# Altium schematic sheet main.SchDoc
size A3; SheetNumber: 1; SheetTotal: 4
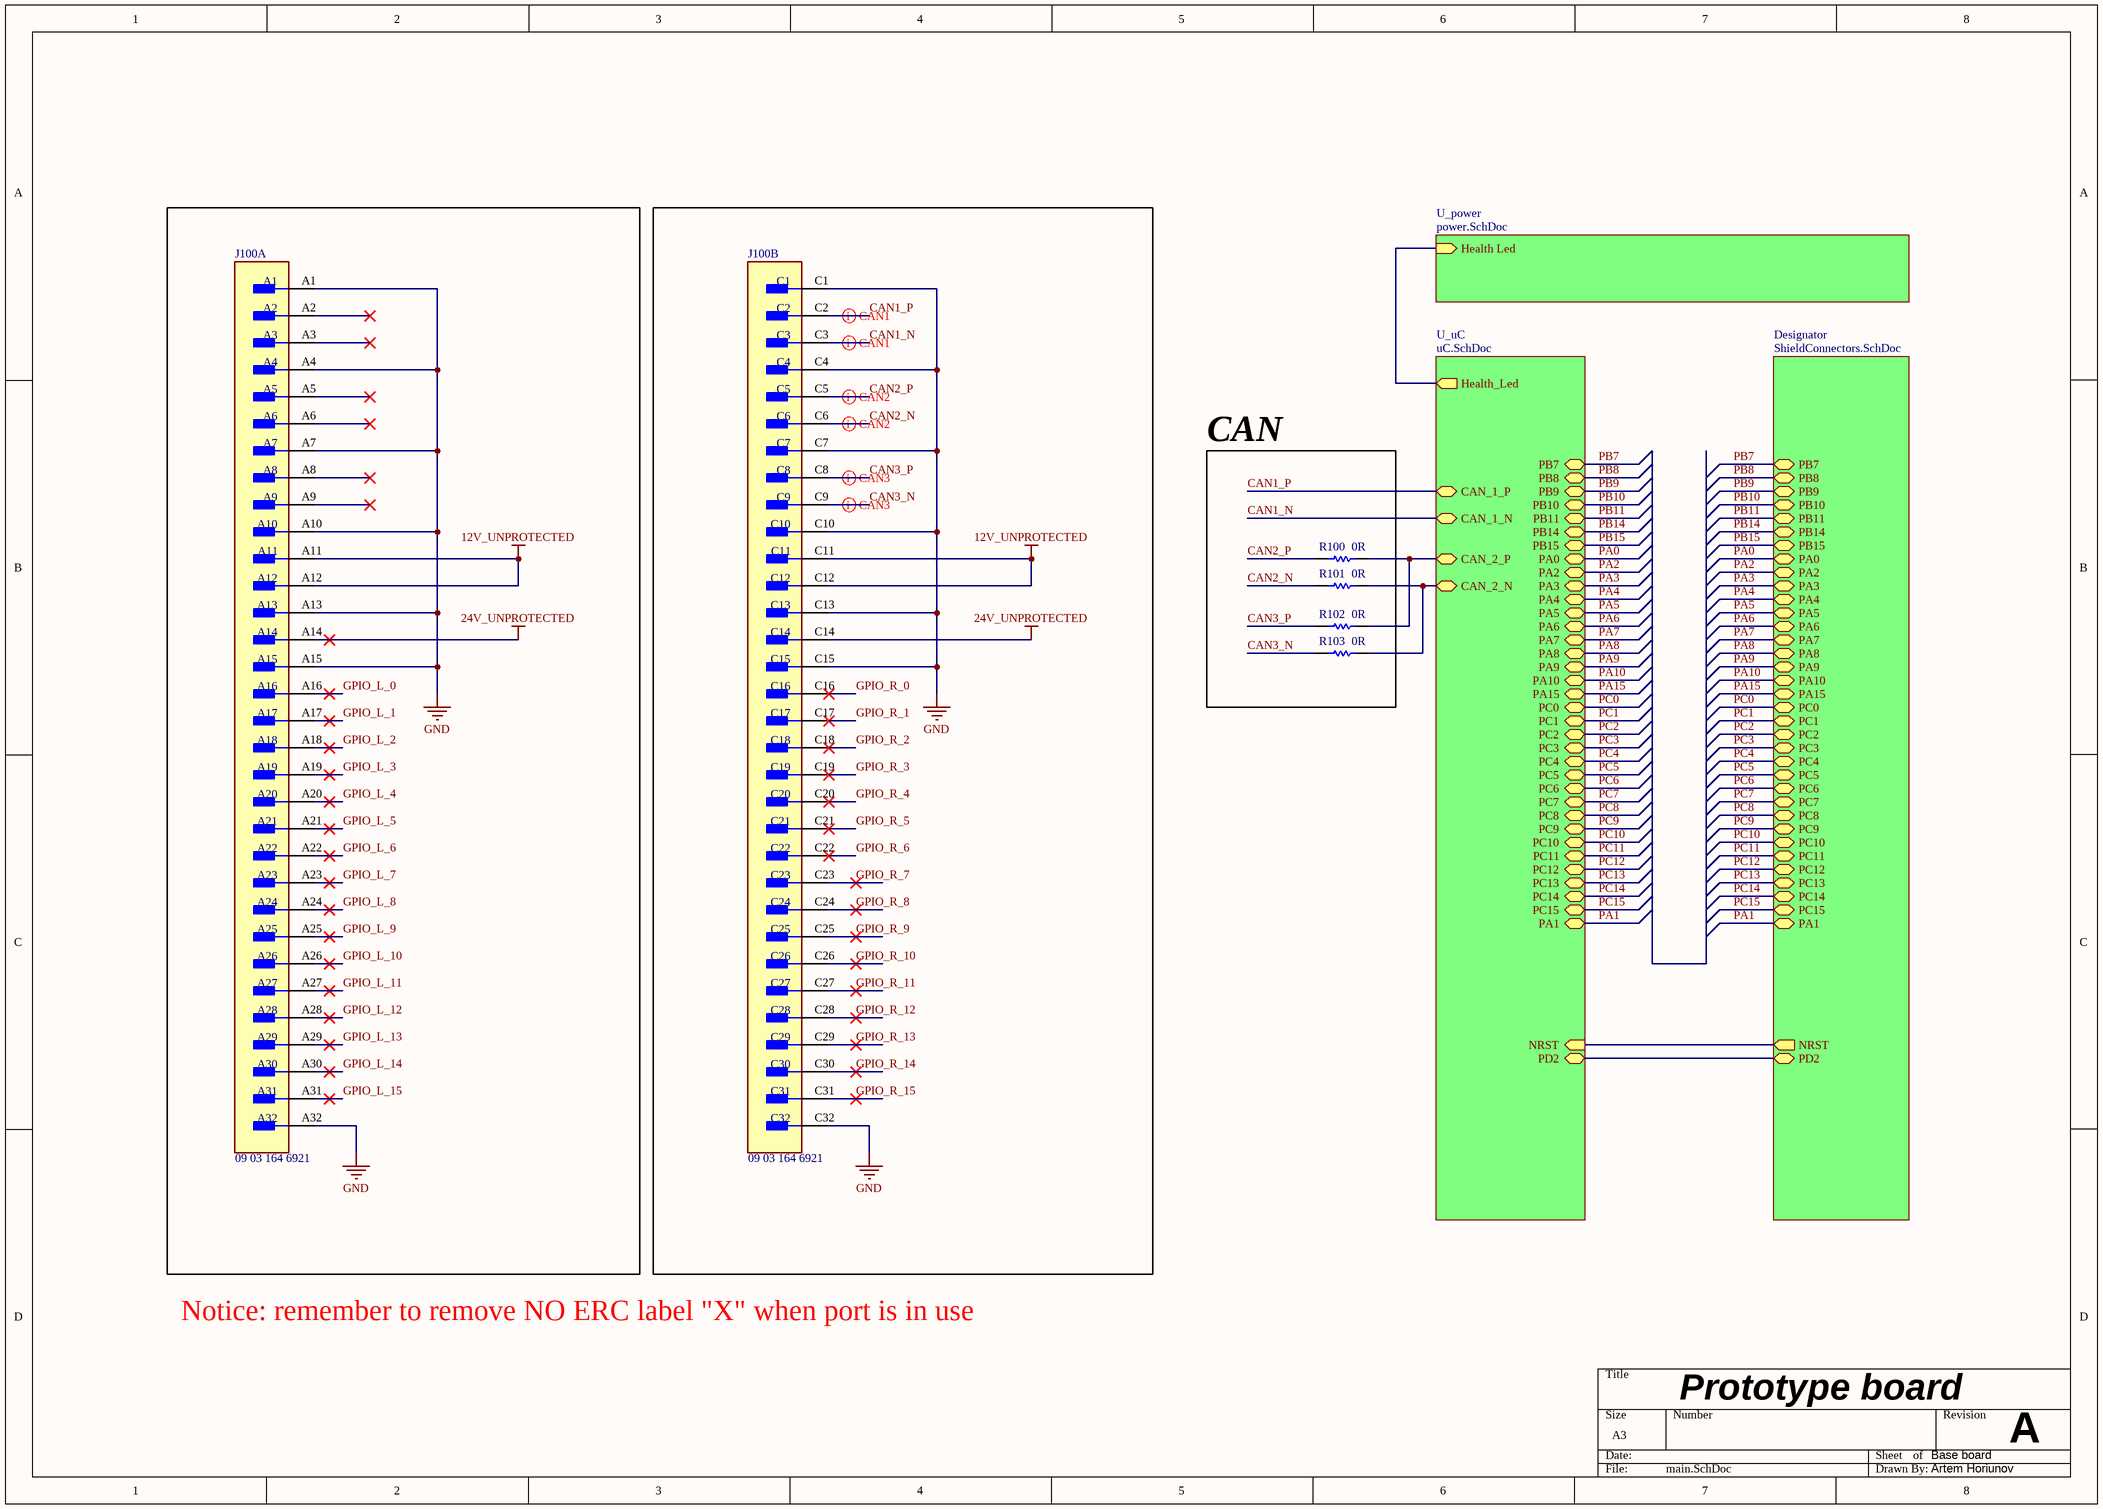
[diagram p0: main.SchDoc]

## Parts
J100  09 03 164 6921  [FP-09_03_164_6921-MFG]  (parts A,B of 2)
R100  0R  [RESC1608X55X25ML10T15]
R101  0R  [RESC1608X55X25ML10T15]
R102  0R  [RESC1608X55X25ML10T15]
R103  0R  [RESC1608X55X25ML10T15]

## Blocks framed on the sheet
CAN: R100-R103

## Sub-sheets
Designator = ShieldConnectors.SchDoc: PB7 (bidir), PB8 (bidir), PB9 (bidir), PB10 (bidir), PB11 (bidir), PB14 (bidir), PB15 (bidir), PA0 (bidir), PA2 (bidir), PA3 (bidir), PA4 (bidir), PA5 (bidir), PA6 (bidir), PA7 (bidir), PA8 (bidir), PA9 (bidir), PA10 (bidir), PC5 (bidir), PC4 (bidir), PC7 (bidir), PC6 (bidir), PC1 (bidir), PC0 (bidir), PC3 (bidir), PC2 (bidir), PC8 (bidir), PC14 (bidir), PC13 (bidir), PA15 (bidir), PC15 (bidir), PC10 (bidir), PC9 (bidir), PC12 (bidir), PC11 (bidir), NRST (out), PD2 (bidir), PA1 (bidir)
U_power = power.SchDoc: Health Led (in)
U_uC = uC.SchDoc: CAN_2_P (bidir), CAN_2_N (bidir), CAN_1_P (bidir), CAN_1_N (bidir), Health_Led (out), PB7 (bidir), PB8 (bidir), PB9 (bidir), PB10 (bidir), PB11 (bidir), PB14 (bidir), PB15 (bidir), PA0 (bidir), PA2 (bidir), PA3 (bidir), PA4 (bidir), PA5 (bidir), PA6 (bidir), PA7 (bidir), PA8 (bidir), PA9 (bidir), PA10 (bidir), PA15 (bidir), PC0 (bidir), PC1 (bidir), PC2 (bidir), PC3 (bidir), PC4 (bidir), PC5 (bidir), PC6 (bidir), PC7 (bidir), PC8 (bidir), PC9 (bidir), PC10 (bidir), PC11 (bidir), PC12 (bidir), PC13 (bidir), PC14 (bidir), PC15 (bidir), PD2 (bidir), NRST (in), PA1 (bidir)

## Nets
12V_UNPROTECTED: J100.A11 J100.A12 J100.C11 J100.C12
24V_UNPROTECTED: J100.A14 J100.C14
GND: J100.A1 J100.A4 J100.A7 J100.A10 J100.A13 J100.A15 J100.A32 J100.C1 J100.C4 J100.C7 J100.C10 J100.C13 J100.C15 J100.C32
CAN1_N: J100.C3 ; sheet U_uC/CAN_1_N
CAN1_P: J100.C2 ; sheet U_uC/CAN_1_P
CAN2_N: J100.C6 R101.1
CAN2_P: J100.C5 R100.1
CAN3_N: J100.C9 R103.1
CAN3_P: J100.C8 R102.1
GPIO_L_0: J100.A16
GPIO_L_1: J100.A17
GPIO_L_2: J100.A18
GPIO_L_3: J100.A19
GPIO_L_4: J100.A20
GPIO_L_5: J100.A21
GPIO_L_6: J100.A22
GPIO_L_7: J100.A23
GPIO_L_8: J100.A24
GPIO_L_9: J100.A25
GPIO_L_10: J100.A26
GPIO_L_11: J100.A27
GPIO_L_12: J100.A28
GPIO_L_13: J100.A29
GPIO_L_14: J100.A30
GPIO_L_15: J100.A31
GPIO_R_0: J100.C16
GPIO_R_1: J100.C17
GPIO_R_2: J100.C18
GPIO_R_3: J100.C19
GPIO_R_4: J100.C20
GPIO_R_5: J100.C21
GPIO_R_6: J100.C22
GPIO_R_7: J100.C23
GPIO_R_8: J100.C24
GPIO_R_9: J100.C25
GPIO_R_10: J100.C26
GPIO_R_11: J100.C27
GPIO_R_12: J100.C28
GPIO_R_13: J100.C29
GPIO_R_14: J100.C30
GPIO_R_15: J100.C31
PA0: sheet U_uC/PA0, sheet Designator/PA0
PA1: sheet U_uC/PA1, sheet Designator/PA1
PA2: sheet U_uC/PA2, sheet Designator/PA2
PA3: sheet U_uC/PA3, sheet Designator/PA3
PA4: sheet U_uC/PA4, sheet Designator/PA4
PA5: sheet U_uC/PA5, sheet Designator/PA5
PA6: sheet U_uC/PA6, sheet Designator/PA6
PA7: sheet U_uC/PA7, sheet Designator/PA7
PA8: sheet U_uC/PA8, sheet Designator/PA8
PA9: sheet U_uC/PA9, sheet Designator/PA9
PA10: sheet U_uC/PA10, sheet Designator/PA10
PA15: sheet U_uC/PA15, sheet Designator/PA15
PB7: sheet U_uC/PB7, sheet Designator/PB7
PB8: sheet U_uC/PB8, sheet Designator/PB8
PB9: sheet U_uC/PB9, sheet Designator/PB9
PB10: sheet U_uC/PB10, sheet Designator/PB10
PB11: sheet U_uC/PB11, sheet Designator/PB11
PB14: sheet U_uC/PB14, sheet Designator/PB14
PB15: sheet U_uC/PB15, sheet Designator/PB15
PC0: sheet U_uC/PC0, sheet Designator/PC0
PC1: sheet U_uC/PC1, sheet Designator/PC1
PC2: sheet U_uC/PC2, sheet Designator/PC2
PC3: sheet U_uC/PC3, sheet Designator/PC3
PC4: sheet U_uC/PC4, sheet Designator/PC4
PC5: sheet U_uC/PC5, sheet Designator/PC5
PC6: sheet U_uC/PC6, sheet Designator/PC6
PC7: sheet U_uC/PC7, sheet Designator/PC7
PC8: sheet U_uC/PC8, sheet Designator/PC8
PC9: sheet U_uC/PC9, sheet Designator/PC9
PC10: sheet U_uC/PC10, sheet Designator/PC10
PC11: sheet U_uC/PC11, sheet Designator/PC11
PC12: sheet U_uC/PC12, sheet Designator/PC12
PC13: sheet U_uC/PC13, sheet Designator/PC13
PC14: sheet U_uC/PC14, sheet Designator/PC14
PC15: sheet U_uC/PC15, sheet Designator/PC15
NetR100_2: R100.2 R102.2 ; sheet U_uC/CAN_2_P
NetR101_2: R101.2 R103.2 ; sheet U_uC/CAN_2_N
(unnamed): sheet U_power/Health Led, sheet U_uC/Health_Led
(unnamed): sheet U_uC/PD2, sheet Designator/PD2
(unnamed): sheet U_uC/NRST, sheet Designator/NRST

Not connected (* = marked no-connect by the designer): J100 A2* A3* A5* A6* A8* A9*

## Layout directives
differential pair: CAN1_N, CAN1_P, CAN2_N, CAN2_P, CAN3_N, CAN3_P

## Notes on the sheet
- Notice: remember to remove NO ERC label "X" when port is in use
- Prototype board
- Base board
- A
- Artem Horiunov

## Library data of the parts
J100 = CMP-33111-000001-1: CONN DIN HDR 96POS PCB RA; Manufacturer: Harting; Pitch: 2.54mm; Number Of Contacts: 64; Current Rating: 2A; Conn Orientation: Right Angle; Conn Gender: Male; Device Class L1: Connectors; Package: 0; Number Of Rows: 2; ComponentLink2URL: https://b2b.harting.com/files/download/PRD/PDF_DS/09031200203_100580339DRW000B.pdf; Height: 11mm; Temperature Range Low: -55°C; Digikey Description: CONN DIN HDR 96POS PCB RA; Mouser Description: Conn DIN 41612 M 64 POS 2.54mm Solder RA Thru-Hole Box; Footprint Url: https://b2b.harting.com/files/download/PRD/PDF_TS/0903164X921_100072506DRW176A.pdf; Lead Free: Yes; RoHS: TRUE; Device Class L2: Backplane Connectors; Category: Conn; Manufacturer Part Number: 09 03 164 6921; Temperature Range High: +125°C; Temperature: -55°C to +125°C; ComponentLink2Description: Datasheet; Octopart: https://octopart.com/09031646921-harting+elektronik-42933; Device Class L3: unset; Automotive: No; Contact Material: Gold,Nickel
R100-R103 = CMP-2100-03667-1: Chip Resistor, 0 Ohm, +/- 5%, 0.1 W, -55 to 155 degC, 0603 (1608 Metric), RoHS, Tape and Reel; Manufacturer: Yageo; Temperature Coefficient: 200ppm/degreesC; Voltage Rating: 50V; Power Rating: 100mW; Resistance: 0mOhm; Width: 0.8mm; Max Operating Temperature: 155degC; Tolerance: 5%; Package Reference: 0603; Height: 0.45mm; Depth: 0.8mm; Package Description: 2-Pin Surface Mount Device, Body 1.6 x 0.8 mm; Termination: SMD/SMT; Package Quantity: 5000; Case/Package: 0603; Case Code (Imperial): 0603; Radiation Hardening: No; Number of Pins: 2; Length: 1.6mm; Lead Free: LeadFree; Voltage Rating (DC): 50V; Military Standard: Not; Datasheet URL: http://www.yageo.com/NewPortal/yageodocoutput?fileName=/pdf/R-Chip/PYu-RC_Group_51_RoHS_L_5.pdf; Manufacturer URL: http://www.yageo.com/; Packaging: TapeandReel; Case Code (Metric): 1608; Min Operating Temperature: -55degC; Composition: ThickFilm; RoHSCompliant: true; Contact Plating: Tin; Datasheet Version: Rev. 5, 10/2016; REACH SVHC: NoSVHC